# EAGLE design alim (EAGLE 4.16)
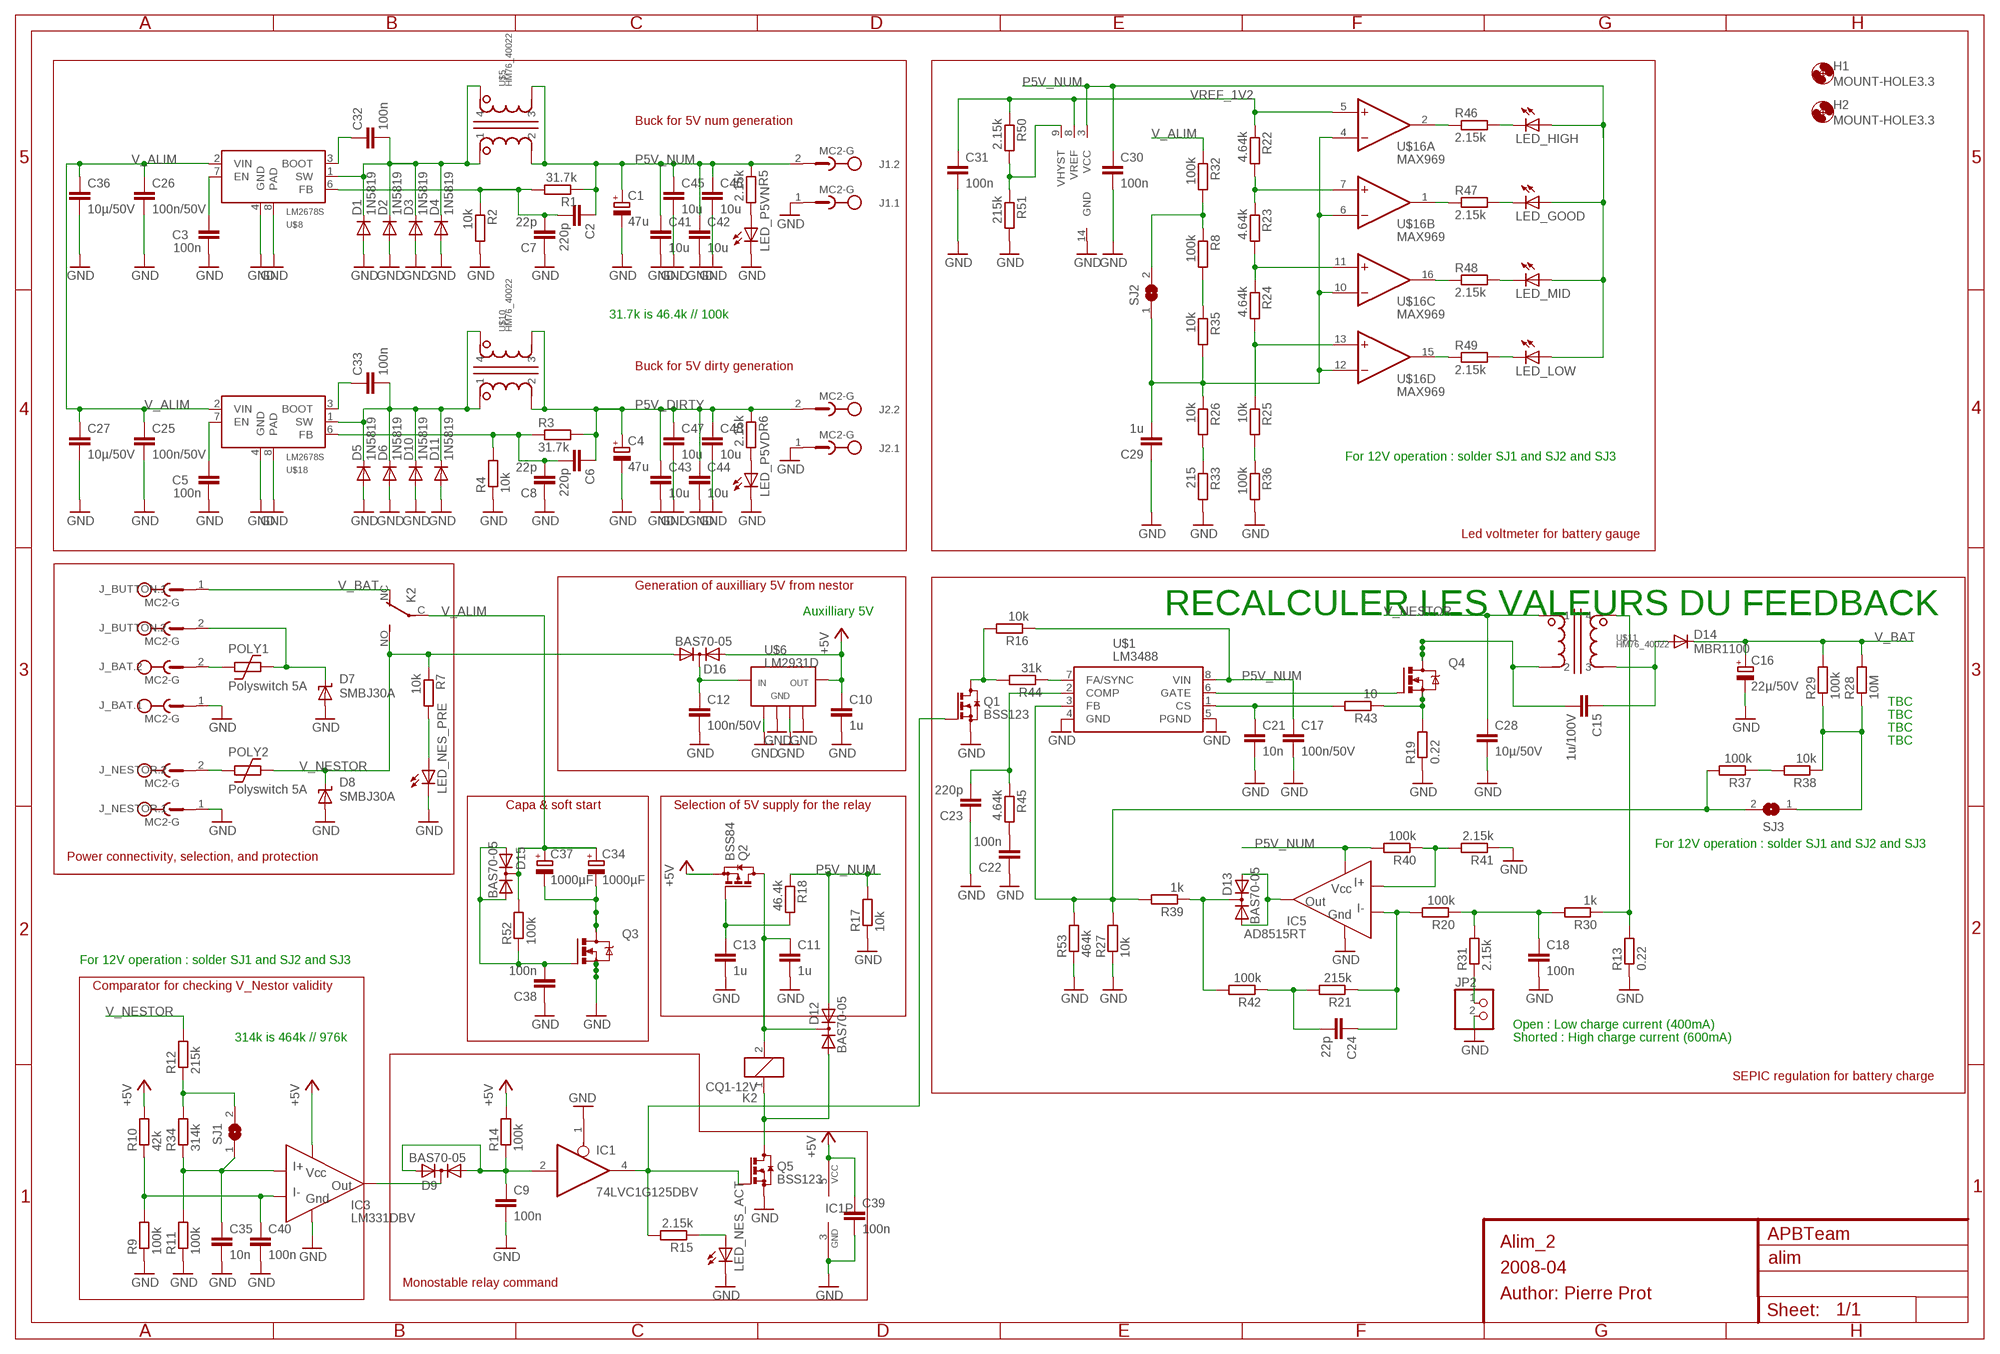
[diagram p0: schematic, sheet 1]

## Parts
C1  47u  CPOL-EUE  [PANASONIC_E]
C2  220p  C-EUC0603  [C0603]
C3  100n  C-EUC0603  [C0603]
C4  47u  CPOL-EUE  [PANASONIC_E]
C5  100n  C-EUC0603  [C0603]
C6  220p  C-EUC0603  [C0603]
C7  22p  C-EUC0603  [C0603]
C8  22p  C-EUC0603  [C0603]
C9  100n  C-EUC0603  [C0603]
C10  1u  C-EUC0603  [C0603]
C11  1u  C-EUC0603  [C0603]
C12  100n/50V  C-EUC0805  [C0805]
C13  1u  C-EUC0603  [C0603]
C15  1u/100V  C-EUC1206K  [C1206K]
C16  22µ/50V  CPOL-EUE  [PANASONIC_E]
C17  100n/50V  C-EUC0805  [C0805]
C18  100n  C-EUC0603  [C0603]
C21  10n  C-EU0603_SMALL  [0603_SMALL]
C22  100n  C-EU0603_SMALL  [0603_SMALL]
C23  220p  C-EU0603_SMALL  [0603_SMALL]
C24  22p  C-EUC0603  [C0603]
C25  100n/50V  C-EUC0805  [C0805]
C26  100n/50V  C-EUC0805  [C0805]
C27  10µ/50V  C-EUC2220K  [C2220K]
C28  10µ/50V  C-EUC2220K  [C2220K]
C29  1u  C-EUC0603  [C0603]
C30  100n  C-EUC0603  [C0603]
C31  100n  C-EUC0603  [C0603]
C32  100n  C-EUC0603  [C0603]
C33  100n  C-EUC0603  [C0603]
C34  1000µF  CPOL-EU""  [E5-13_RADIAL$]
C35  10n  C-EUC0603  [C0603]
C36  10µ/50V  C-EUC2220K  [C2220K]
C37  1000µF  CPOL-EU""  [E5-13_RADIAL$]
C38  100n  C-EUC0603  [C0603]
C39  100n  C-EUC0603  [C0603]
C40  100n  C-EU0603_SMALL  [0603_SMALL]
C41  10u  C-EUC0603  [C0603]
C42  10u  C-EUC0603  [C0603]
C43  10u  C-EUC0603  [C0603]
C44  10u  C-EUC0603  [C0603]
C45  10u  C-EUC0603  [C0603]
C46  10u  C-EUC0603  [C0603]
C47  10u  C-EUC0603  [C0603]
C48  10u  C-EUC0603  [C0603]
D1  1N5819  DIODE-DO41-10  [DO41-10]
D2  1N5819  DIODE-DO41-10  [DO41-10]
D3  1N5819  DIODE-DO41-10  [DO41-10]
D4  1N5819  DIODE-DO41-10  [DO41-10]
D5  1N5819  DIODE-DO41-10  [DO41-10]
D6  1N5819  DIODE-DO41-10  [DO41-10]
D7  SMBJ30A  SUPPRESSOR-SMBJ  [SMBJ]
D8  SMBJ30A  SUPPRESSOR-SMBJ  [SMBJ]
D9  BAS70-05  [SOT23]
D10  1N5819  DIODE-DO41-10  [DO41-10]
D11  1N5819  DIODE-DO41-10  [DO41-10]
D12  BAS70-05  [SOT23]
D13  BAS70-05  [SOT23]
D14  MBR1100  DIODE-DO41-10  [DO41-10]
D15  BAS70-05  [SOT23]
D16  BAS70-05  [SOT23]
H1  MOUNT-HOLE3.3  [3,3]
H2  MOUNT-HOLE3.3  [3,3]
IC1  74LVC1G125DBV  [SOT23-5]
IC3  LM331DBV  [SOT23-6]
IC5  AD8515RT  [SOT23-5]
J1  MC2-G  [MC2-G]
J2  MC2-G  [MC2-G]
J_BAT  MC2-G  [MC2-G]
J_BUTTON  MC2-G  [MC2-G]
J_NESTOR  MC2-G  [MC2-G]
JP2  PINHD-1X2  [1X02]
K2  CQ1-12V  [CQ1]
LED_GOOD  LEDCHIPLED_1206  [CHIPLED_1206]
LED_HIGH  LEDCHIPLED_1206  [CHIPLED_1206]
LED_LOW  LEDCHIPLED_1206  [CHIPLED_1206]
LED_MID  LEDCHIPLED_1206  [CHIPLED_1206]
LED_NES_ACT  LEDCHIPLED_1206  [CHIPLED_1206]
LED_NES_PRE  LEDCHIPLED_1206  [CHIPLED_1206]
LED_P5VD  LEDCHIPLED_1206  [CHIPLED_1206]
LED_P5VN  LEDCHIPLED_1206  [CHIPLED_1206]
POLY1  Polyswitch 5A  POLYSWITCH_0411/12  [0411/12]
POLY2  Polyswitch 5A  POLYSWITCH_0411/12  [0411/12]
Q1  BSS123  [SOT23]
Q2  BSS84  [SOT23]
Q3  N-MOSFET-SO8S  [SO-08]
Q4  N-MOSFET-SO8S  [SO-08]
Q5  BSS123  [SOT23]
R1  31.7k  R-EU_R0603  [R0603]
R2  10k  R-EU_R0603  [R0603]
R3  31.7k  R-EU_R0603  [R0603]
R4  10k  R-EU_R0603  [R0603]
R5  2.15k  R-EU_R0603  [R0603]
R6  2.15k  R-EU_R0603  [R0603]
R7  10k  R-EU_R0603  [R0603]
R8  100k  R-EU_R0603  [R0603]
R9  100k  R-EU_R0603  [R0603]
R10  42k  R-EU_R0603  [R0603]
R11  100k  R-EU_R0603  [R0603]
R12  215k  R-EU_R0603  [R0603]
R13  0.22  R-EU_R0603  [R0603]
R14  100k  R-EU_R0603  [R0603]
R15  2.15k  R-EU_R0603  [R0603]
R16  10k  R-EU_R0603  [R0603]
R17  10k  R-EU_R0603  [R0603]
R18  46.4k  R-EU_R0603  [R0603]
R19  0.22  R-EU_R0603  [R0603]
R20  100k  R-EU_R0603  [R0603]
R21  215k  R-EU_R0603  [R0603]
R22  4.64k  R-EU_R0603  [R0603]
R23  4.64k  R-EU_R0603  [R0603]
R24  4.64k  R-EU_R0603  [R0603]
R25  10k  R-EU_R0603  [R0603]
R26  10k  R-EU_R0603  [R0603]
R27  10k  R-EU_0603_SMALL  [0603_SMALL]
R28  10M  R-EU_R0603  [R0603]
R29  100k  R-EU_R0603  [R0603]
R30  1k  R-EU_R0603  [R0603]
R31  2.15k  R-EU_R0603  [R0603]
R32  100k  R-EU_R0603  [R0603]
R33  215  R-EU_R0603  [R0603]
R34  314k  R-EU_R0603  [R0603]
R35  10k  R-EU_R0603  [R0603]
R36  100k  R-EU_R0603  [R0603]
R37  100k  R-EU_R0603  [R0603]
R38  10k  R-EU_R0603  [R0603]
R39  1k  R-EU_R0603  [R0603]
R40  100k  R-EU_R0603  [R0603]
R41  2.15k  R-EU_R0603  [R0603]
R42  100k  R-EU_R0603  [R0603]
R43  10  R-EU_R0603  [R0603]
R44  31k  R-EU_R0603  [R0603]
R45  4.64k  R-EU_0603_SMALL  [0603_SMALL]
R46  2.15k  R-EU_R0603  [R0603]
R47  2.15k  R-EU_R0603  [R0603]
R48  2.15k  R-EU_R0603  [R0603]
R49  2.15k  R-EU_R0603  [R0603]
R50  2.15k  R-EU_R0603  [R0603]
R51  215k  R-EU_R0603  [R0603]
R52  100k  R-EU_R0603  [R0603]
R53  464k  R-EU_0603_SMALL  [0603_SMALL]
SJ1  SJ  [SJ]
SJ2  SJ  [SJ]
SJ3  SJ  [SJ]
U$1  LM3488  [MSOP8]
U$5  HM76_40022  HM76_40  [HM76_40]
U$6  LM2931D  LM2931  [SO08]
U$8  LM2678S  [TO263-7]
U$10  HM76_40022  HM76_40  [HM76_40]
U$11  HM76_40022  HM76_40  [HM76_40]
U$16  MAX969  [QSOP16]
U$18  LM2678S  [TO263-7]

## Nets
+5V: C10.1 C39.1 D16.2(A2) IC1.5(VCC) IC3.6(VCC) Q2.2(S) R10.2 R14.2 U$6.1(OUT)
GND: C1.- C3.1 C4.- C5.1 C7.1 C8.1 C9.2 C10.2 C11.2 C12.2 C13.2 C16.- C17.2 C18.2 C21.2 C22.1 C23.1 C25.2 C26.2 C27.2 C28.2 C29.1 C30.2 C31.2 C35.2 C36.2 C38.1 C39.2 C40.2 C41.2 C42.2 C43.2 C44.2 C45.2 C46.2 C47.2 C48.2 D1.A D2.A D3.A D4.A D5.A D6.A D7.A D8.A D10.A D11.A IC1.1(OE) IC1.3(GND) IC3.2(VSS) IC5.2(VSS) J1.1 J2.1 J_BAT.1 J_NESTOR.1 JP2.2 LED_NES_ACT.C LED_NES_PRE.C LED_P5VD.C LED_P5VN.C Q1.2(S) Q3.1(S) Q3.2(S) Q3.3(S) Q5.2(S) R2.2 R4.1 R9.1 R11.1 R13.1 R17.1 R19.1 R27.1 R33.2 R36.2 R41.1 R51.2 R53.1 U$1.4(GND) U$1.5(PGND) U$6.2(GND) U$6.3(GND2) U$6.6(GND3) U$6.7(GND4) U$8.4(GND) U$8.8(PAD) U$16.14(GND) U$18.4(GND) U$18.8(PAD)
N$1: C32.2 D1.C D2.C D3.C D4.C U$5.P$1 U$5.P$4 U$8.1(SW)
N$2: D12.1(A1) K2.1 Q5.3(D)
N$3: C2.2 C7.2 R1.2 R2.1 U$8.6(FB)
N$4: C6.2 C8.2 R3.1 R4.2 U$18.6(FB)
N$5: C5.2 U$18.7(EN)
N$6: C3.2 U$8.7(EN)
N$7: IC1.4(O) Q1.1(G) Q5.1(G) R15.2
N$8: C33.2 D5.C D6.C D10.C D11.C U$10.P$1 U$10.P$4 U$18.1(SW)
N$9: LED_P5VN.A R5.2
N$10: LED_P5VD.A R6.2
N$11: LED_NES_PRE.A R7.2
N$12: J_BAT.2 POLY1.1
N$13: J_NESTOR.2 POLY2.1
N$14: C40.1 IC3.3(I-) R9.2 R10.1
N$15: C35.1 IC3.1(I+) R11.2 R34.1 SJ1.1
N$16: C9.1 D9.1(A1) D9.2(A2) IC1.2(I) R14.1
N$17: D9.3(C) IC3.4(OUT)
N$18: LED_NES_ACT.A R15.1
N$19: C13.1 Q2.1(G) R18.2
N$20: R22.2 R23.1 U$16.7(B:+IN)
N$21: Q4.4(G) U$1.6(GATE)
N$22: D7.C J_BUTTON.2 POLY1.2
N$23: Q1.3(D) R16.2 R44.2
N$24: C11.1 D12.3(C) K2.2 Q2.3(D)
N$25: Q4.1(S) Q4.2(S) Q4.3(S) R19.2 R43.1
N$26: C21.1 R43.2 U$1.1(CS)
N$27: R46.1 U$16.2(A:OUT)
N$28: R44.1 U$1.7(FA/SYNC)
N$29: R23.2 R24.1 U$16.11(C:+IN)
N$30: R24.2 R25.1 U$16.13(D:+IN)
N$31: R50.2 R51.1 U$16.9(VHYST)
N$32: C29.2 R26.1 R35.2 SJ2.1 U$16.4(A:-IN) U$16.6(B:-IN) U$16.10(C:-IN) U$16.12(D:-IN)
N$33: R8.2 R35.1
N$34: C15.2 Q4.5(D) Q4.6(D) Q4.7(D) Q4.8(D) U$11.P$2
N$35: C15.1 D14.A U$11.P$3
N$36: R28.1 R29.1 R38.1 SJ3.1
N$37: R47.1 U$16.1(B:OUT)
N$40: R13.2 R30.1 U$11.P$4
N$41: C18.1 R20.1 R30.2 R31.2
N$42: R12.1 R34.2 SJ1.2
N$43: R8.1 R32.2 SJ2.2
N$44: C32.1 U$8.3(BOOT)
N$45: R26.2 R33.1
N$46: R25.2 R36.1
N$47: R37.1 R38.2
N$48: D13.1(A1) D13.2(A2) IC5.1(OUT)
N$49: D13.3(C) R39.1 R42.2
N$50: R27.2 R37.2 R39.2 R53.2 SJ3.2 U$1.3(FB)
N$51: C24.1 IC5.4(I-) R20.2 R21.1
N$52: IC5.3(I+) R40.1 R41.2
N$53: C24.2 R21.2 R42.1
N$54: JP2.1 R31.1
N$55: R48.1 U$16.16(C:OUT)
N$56: LED_HIGH.C R46.2
N$57: LED_GOOD.C R47.2
N$58: LED_MID.C R48.2
N$59: C23.2 R45.1 U$1.2(COMP)
N$60: C22.2 R45.2
N$61: R49.1 U$16.15(D:OUT)
N$62: LED_LOW.C R49.2
N$66: C33.1 U$18.3(BOOT)
N$68: C38.2 D15.1(A1) D15.2(A2) Q3.4(G) R52.1
N$69: C34.- C37.- Q3.5(D) Q3.6(D) Q3.7(D) Q3.8(D)
N$73: C12.1 D16.3(C) U$6.8(IN)
P5V_DIRTY: C4.+ C6.1 C43.1 C44.1 C47.1 C48.1 J2.2 R3.2 R6.1 U$10.P$2 U$10.P$3
P5V_NUM: C1.+ C2.1 C17.1 C30.1 C41.1 C42.1 C45.1 C46.1 D12.2(A2) IC5.5(VCC) J1.2 LED_GOOD.A LED_HIGH.A LED_LOW.A LED_MID.A R1.1 R5.1 R16.1 R17.2 R18.1 R40.2 U$1.8(VIN) U$5.P$2 U$5.P$3 U$16.3(VCC)
V_ALIM: C25.1 C26.1 C27.1 C34.+ C36.1 C37.+ D15.3(C) K2.C(2:P) R32.1 R52.2 U$8.2(VIN) U$18.2(VIN)
V_BAT: C16.+ D14.C J_BUTTON.1 K2.NC(2:O) R28.2 R29.2
V_NESTOR: C28.1 D8.C D16.1(A1) K2.NO(2:S) POLY2.2 R7.1 R12.2 U$11.P$1
VREF_1V2: C31.1 R22.1 R50.1 U$16.5(A:+IN) U$16.8(VREF)

## Notes on the sheet
- Buck for 5V num generation
- 31.7k is 46.4k // 100k
- Buck for 5V dirty generation
- For 12V operation : solder SJ1 and SJ2 and SJ3
- Led voltmeter for battery gauge
- Generation of auxilliary 5V from nestor
- Auxilliary 5V | RECALCULER LES VALEURS DU FEEDBACK
- TBC
- TBC
- TBC
- TBC
- Capa & soft start | Selection of 5V supply for the relay
- For 12V operation : solder SJ1 and SJ2 and SJ3
- Power connectivity, selection, and protection
- For 12V operation : solder SJ1 and SJ2 and SJ3
- Comparator for checking V_Nestor validity
- Open : Low charge current (400mA)
- 314k is 464k // 976k | Shorted : High charge current (600mA)
- SEPIC regulation for battery charge
- APBTeam
- Alim_2
- 2008-04
- Monostable relay command
- Author: Pierre Prot

## Library data of the parts
C1 C4 C16 C34 C37 = rcl:CPOL-EU: POLARIZED CAPACITOR, European symbol
C2 C3 C5-C13 C15 C17 C18 C21-C33 C35 C36 C38-C48 = rcl:C-EU: CAPACITOR, European symbol
D1-D6 D10 D11 D14 = diode:DIODE-: DIODE
D7 D8 = diode:SUPPRESSOR-: Suppressor diode
D9 D12 D13 D15 D16 = diode:BAS70-05: Silicon Schottky Diodes General-purpose diode for high-speed switching
H1 H2 = holes:MOUNT-HOLE: MOUNTING HOLE with drill center marker
IC1 = 74xx-little-us:74*1G125: Single Bus Buffer Gate with 3-State Output
IC3 = robot:LM331
IC5 = robot:AD8515
J1 J2 J_BAT J_BUTTON J_NESTOR = con-phoenix-381_l:MC2-G: Mini-Combicon 3.81mm horizontal 2-polig MC 1,5/2-G-3,81 Artikel-Nr. 1803277 mit Gegenstecker MC 1,5/2-ST-3,81 Artikel-Nr. 1803578
JP2 = pinhead:PINHD-1X2: PIN HEADER
K2 = relay:CQ1-12V: AUTOMOTIVE QUIET RELAY NAiS Source: http://www.mew-europe.com/.. en_ds_61208_0000.pdf
LED_GOOD LED_HIGH LED_LOW LED_MID LED_NES_ACT LED_NES_PRE LED_P5VD LED_P5VN = led:LED: LED OSRAM: - CHIPLED LG R971, LG N971, LY N971, LG Q971, LY Q971, LO R971, LY R971 LH N974, LH R974 LS Q976, LO Q976, LY Q976 LO Q996 - Hyper CHIPLED LW Q18S LB Q993, LB Q99A, LB R99A - SideLED LS A670, LO A670, LY A670, LG A670, LP A670 LB A673, LV A673, LT A673, LW A673 LH A674 LY A675 LS A676, LA A676, LO A676, LY A676, LW A676 LS A679, LY A679, LG A679 - Hyper Micro SIDELED® LS Y876, LA Y876, LO Y876, LY Y876 LT Y87S - SmartLED LW L88C, LW L88S LB L89C, LB L89S, LG L890 LS L89K, LO L89K, LY L89K LS L896, LA L896, LO L896, LY L896 - TOPLED LS T670, LO T670, LY T670, LG T670, LP T670 LSG T670, LSP T670, LSY T670, LOP T670, LYG T670 LG T671, LOG T671, LSG T671 LB T673, LV T673, LT T673, LW T673 LH T674 LS T676, LA T676, LO T676, LY T676, LB T676, LH T676, LSB T676, LW T676 LB T67C, LV T67C, LT T67C, LS T67K, LO T67K, LY T67K, LW E67C LS E67B, LA E67B, LO E67B, LY E67B, LB E67C, LV E67C, LT E67C LW T67C LS T679, LY T679, LG T679 LS T770, LO T770, LY T770, LG T770, LP T770 LB T773, LV T773, LT T773, LW T773 LH T774 LS E675, LA E675, LY E675, LS T675 LS T776, LA T776, LO T776, LY T776, LB T776 LHGB T686 LT T68C, LB T68C - Hyper Mini TOPLED® LB M676 - Mini TOPLED Santana® LG M470 LS M47K, LO M47K, LY M47K Source: http://www.osram.convergy.de/
POLY1 POLY2 = apbteam_polyswitch:POLYSWITCH_: POLYSWITCH
Q1 Q5 = transistor-small-signal:BSS123: N-CHANNEL MOS FET
Q2 = transistor-small-signal:BSS84: P-CHANNEL MOS FET
Q3 Q4 = transistor-power:N-MOSFET-SO8: N-Channel MOSFET Example: FDS7760A; N-Channel Logic Level PowerTrench® MOSFET FDS2572; N-Channel UltraFET® Trench MOSFET Source: www.fairchildsemi.com
R1-R53 = rcl:R-EU_: RESISTOR, European symbol
SJ1-SJ3 = jumper:SJ: SMD solder JUMPER
U$1 = robot:LM3488
U$5 U$10 U$11 = robot:HM76_40
U$6 = robot:LM2931
U$8 U$18 = robot:LM2678
U$16 = maxim-7:MAX969

## Board
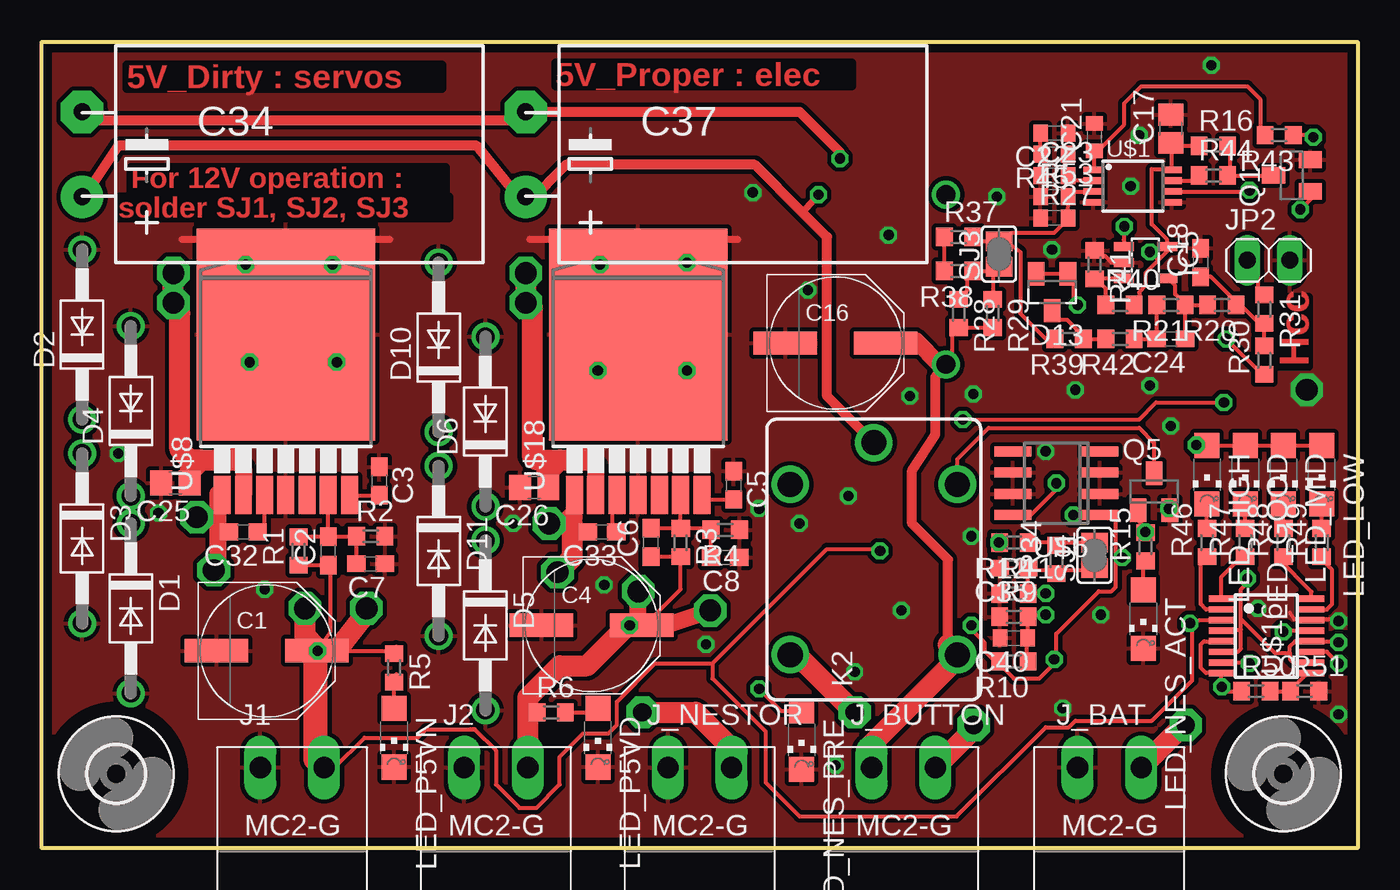
[diagram p1: board, top side]
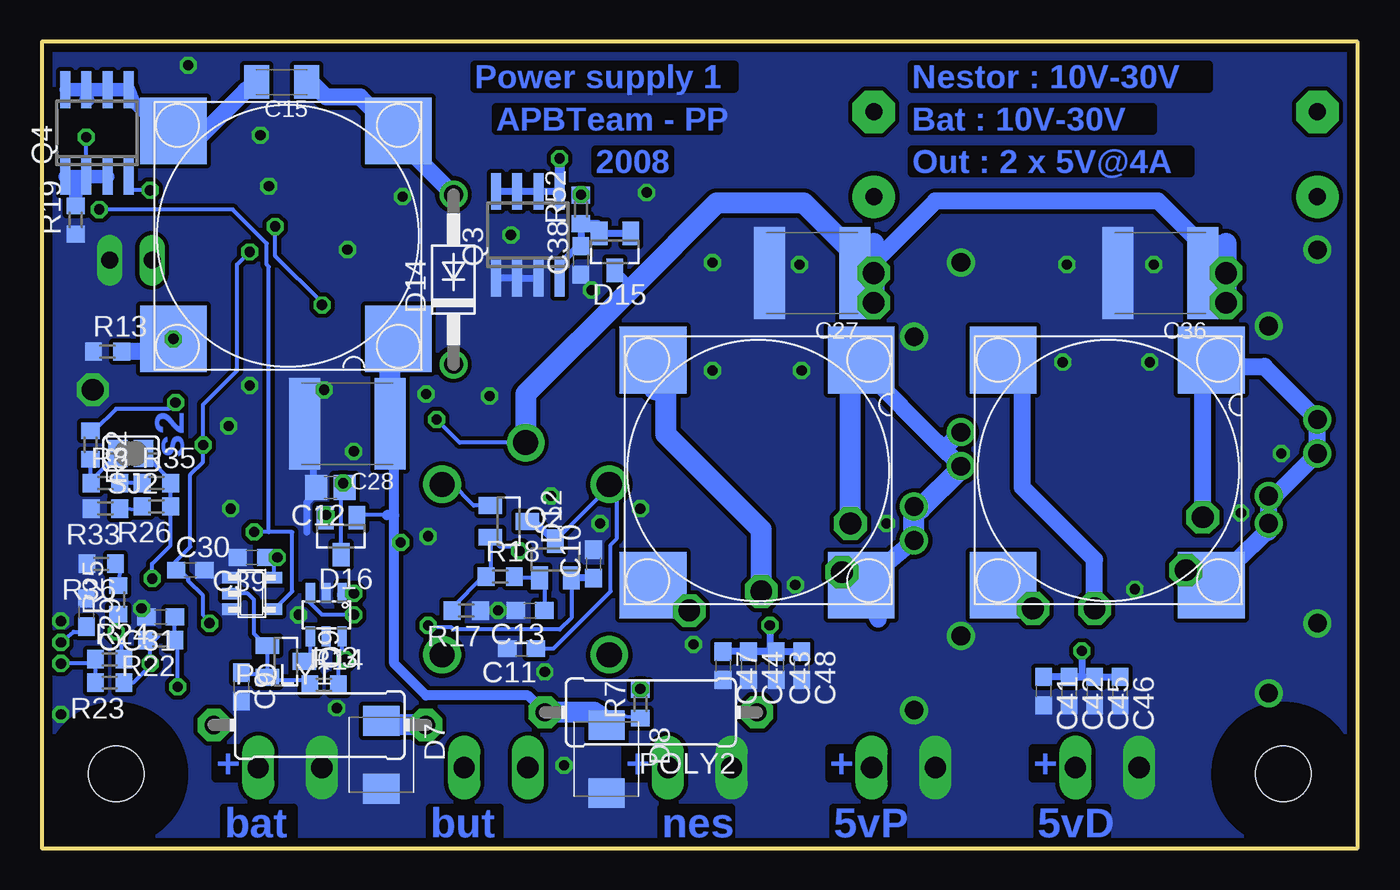
[diagram p2: board, bottom side, seen from below]

Size 78.74 x 48.26 mm. Coordinates in mm from the lower left corner, seen from the top.
Outline: 78.74,0 0,0 0,48.26 78.74,48.26 78.74,0
Copper layers (1*16): Top 0.035mm / dielectric 1.5mm / Bottom 0.035mm
Design rules "10mils": minimum track width 10mil, minimum drill 24mil, track to track 10mil, track to pad 10mil, pad to pad 10mil, via to via 10mil, smd to smd 0mil, copper to edge 20mil, drill to drill 8mil, minimum pad ring 10mil, minimum via ring 8mil, stop-mask expansion 0mil, vias tented up to drill 0mil, thermal gap 10mil

### Footprints (pad centres in the part's own frame; a part is rotated, then mirrored left to right if it is on the bottom)
PANASONIC_E = smd 3.8 x 1.4: + 3,0; - -3,0
C0603 = smd 1.1 x 1: 1 -0.85,0; 2 0.85,0
C0805 = smd 1.3 x 1.5: 1 -0.85,0; 2 0.85,0
C1206K = smd 1.5 x 2: 1 -1.5,0; 2 1.5,0
0603_SMALL = smd 0.864 x 1.016: 1 -0.825,0; 2 0.825,0
C2220K = smd 1.85 x 5.5: 1 -2.55,0; 2 2.55,0
E5-13_RADIAL$ = drill 1.016 pad 2.54 round: + 2.54,0 | drill 1.016 pad 2.54 octagon: - -2.54,0
DO41-10 = drill 1.118 round: A 5.08,0; C -5.08,0
SMBJ = smd 1.78 x 2.16: A 2.04,0; C -2.03,0
SOT23 = smd 1 x 1.4: 1 -0.95,-1.1; 2 0.95,-1.1; 3 0,1.1
3,3 = hole 3.3: 0,0
SOT23-5 = smd 0.69 x 0.99: 1 -0.95,-1.29; 2 0,-1.29; 3 0.95,-1.29; 4 0.95,1.3; 5 -0.95,1.3
SOT23-6 = smd 0.55 x 1.2: 1 -0.95,-1.3; 2 0,-1.3; 3 0.95,-1.3; 4 0.95,1.3; 5 0,1.303; 6 -0.95,1.3
SOT23-5' = smd 0.55 x 1.2: 1 -0.95,-1.3; 2 0,-1.3; 3 0.95,-1.3; 4 0.95,1.3; 5 -0.95,1.3
MC2-G = drill 1.27 long: 1 -1.905,0; 2 1.905,0
1X02 = drill 1.016 long: 1 -1.27,0; 2 1.27,0
CQ1 = drill 1.5 round: 1 4.5,-5; 2 4.5,5; C 7,0; NC -5.7,-5; NO -5.7,5
CHIPLED_1206 = smd 1.5 x 1.5: A 0,-1.75; C 0,1.75
0411/12 = drill 1.1 pad 1.93 octagon: 1 -6.35,0; 2 6.35,0
SO-08 = smd 0.6 x 2.2: 1 -1.905,-2.6; 2 -0.635,-2.6; 3 0.635,-2.6; 4 1.905,-2.6; 5 1.905,2.6; 6 0.635,2.6; 7 -0.635,2.6; 8 -1.905,2.6
R0603 = smd 1 x 1.1: 1 -0.85,0; 2 0.85,0
SJ = smd 1.168 x 1.6: 1 -0.762,0; 2 0.762,0
MSOP8@1 = smd 0.395 x 1.2: 1 -0.975,-2.35; 2 -0.325,-2.35; 3 0.325,-2.35; 4 0.975,-2.35; 5 0.975,2.35; 6 0.325,2.35; 7 -0.325,2.35; 8 -0.975,2.35
HM76_40 = smd 3.988 x 3.988: P$1 -6.604,5.842; P$2 6.858,-6.604; P$3 -6.604,-6.604; P$4 6.858,5.842
SO08 = smd 0.6 x 2.2: 1 -1.905,-2.6; 2 -0.635,-2.6; 3 0.635,-2.6; 4 1.905,-2.6; 5 1.905,2.6; 6 0.635,2.6; 7 -0.635,2.6; 8 -1.905,2.6
TO263-7 = smd 1.016 x 2.286: 1 -3.81,-5.791; 2 -2.54,-5.791; 3 -1.27,-5.791; 4 0,-5.791; 5 1.27,-5.791; 6 2.54,-5.791; 7 3.81,-5.791 | smd 10.668 x 12.7: 8 0,3.81
QSOP16 = smd 0.381 x 1.524: 1 -2.223,-2.69; 2 -1.587,-2.69; 3 -0.953,-2.69; 4 -0.318,-2.69; 5 0.318,-2.69; 6 0.953,-2.69; 7 1.587,-2.69; 8 2.223,-2.69; 9 2.223,2.69; 10 1.587,2.69; 11 0.953,2.69; 12 0.318,2.69; 13 -0.318,2.69; 14 -0.953,2.69; 15 -1.587,2.69; 16 -2.223,2.69

### Placement (x,y rotation side)
C1  13.46,11.81 0 top
C2  17.14,17.78 90 top
C3  20.19,21.97 270 top
C4  32.89,13.34 0 top
C5  41.4,21.72 270 top
C6  36.45,18.29 90 top
C7  19.68,17.02 180 top
C8  40.89,17.4 180 top
C9  66.8,9.65 270 bottom
C10  45.72,17.02 90 bottom
C11  50.04,11.94 180 bottom
C12  61.47,21.59 180 bottom
C13  49.53,14.22 180 bottom
C15  64.39,45.85 180 bottom
C16  47.5,30.23 0 top
C17  67.56,43.05 90 top
C18  69.34,35.05 90 top
C21  62.99,42.55 90 top
C22  60.58,42.8 180 top
C23  60.58,40.26 0 top
C24  67.56,30.48 180 top
C25  8,21.84 180 top
C26  29.46,21.59 180 top
C27  32.64,34.42 180 bottom
C28  60.45,25.4 180 bottom
C29  76.07,14.1 270 bottom
C30  69.85,16.64 0 bottom
C31  71.63,13.84 180 bottom
C32  12.06,18.92 180 top
C33  33.53,18.92 180 top
C34  2.41,41.53 270 top
C35  58.17,16.76 180 top
C36  11.81,34.42 180 bottom
C37  28.96,41.53 270 top
C38  46.48,35.18 90 bottom
C39  66.17,17.4 180 bottom
C40  58.17,12.57 180 top
C41  18.8,9.4 270 bottom
C42  17.27,9.4 270 bottom
C43  34.8,10.92 270 bottom
C44  36.45,10.92 270 bottom
C45  15.75,9.4 270 bottom
C46  14.22,9.4 270 bottom
C47  37.97,10.92 270 bottom
C48  33.27,10.92 270 bottom
D1  5.33,14.35 270 top
D2  2.41,30.73 90 top
D3  2.41,18.54 270 top
D4  5.33,26.16 90 top
D5  26.54,13.34 270 top
D6  26.54,25.53 90 top
D7  58.42,5.59 270 bottom
D8  44.96,5.33 270 bottom
D9  64.14,11.18 270 bottom
D10  23.75,29.97 90 top
D11  23.75,17.78 270 top
D12  50.8,19.56 270 bottom
D13  60.45,33.27 180 top
D14  54.1,34.04 90 bottom
D15  44.45,35.69 180 bottom
D16  60.83,18.67 180 bottom
H1  4.45,4.45 90 top
H2  74.3,4.45 90 top
IC1  66.17,15.24 270 bottom
IC3  61.72,13.97 180 bottom
IC5  AD8515RT  [SOT23-5']  66.04,35.05 270 top
J1  14.99,4.83 0 top
J2  27.18,4.83 0 top
J_BAT  63.88,4.83 0 top
J_BUTTON  51.56,4.83 0 top
J_NESTOR  39.37,4.83 0 top
JP2  73.41,35.18 0 top
K2  49.78,17.27 90 top
LED_GOOD  72.01,22.35 180 top
LED_HIGH  69.72,22.35 180 top
LED_LOW  76.58,22.35 180 top
LED_MID  74.3,22.35 180 top
LED_NES_ACT  65.91,13.72 180 top
LED_NES_PRE  45.47,6.48 180 top
LED_P5VD  33.27,6.6 180 top
LED_P5VN  21.08,6.6 180 top
POLY1  62.1,7.37 0 bottom
POLY2  42.29,8.13 180 bottom
Q1  74.8,40.26 90 top
Q2  48.01,17.27 0 bottom
Q3  49.66,36.7 0 bottom
Q4  75.44,42.8 0 bottom
Q5  66.55,21.34 0 top
R1  15.37,17.78 90 top
R2  19.68,18.67 0 top
R3  38.23,18.29 270 top
R4  40.89,19.05 180 top
R5  21.08,10.79 270 top
R6  30.48,8.13 0 top
R7  42.93,8.64 90 bottom
R8  74.93,21.84 0 bottom
R9  58.17,13.84 0 top
R10  58.17,11.18 180 top
R11  58.17,15.24 0 top
R12  58.17,18.29 180 top
R13  74.8,29.72 0 bottom
R14  61.85,9.78 0 bottom
R15  66.04,18.03 90 top
R16  70.1,42.04 0 top
R17  53.34,14.22 180 bottom
R18  51.31,16.26 0 bottom
R19  76.71,37.59 90 bottom
R20  70.61,32.51 180 top
R21  67.56,32.51 180 top
R22  71.63,12.45 180 bottom
R23  74.68,9.91 180 bottom
R24  74.68,11.3 0 bottom
R25  74.17,14.86 90 bottom
R26  71.88,20.45 180 bottom
R27  60.58,37.72 0 top
R28  54.86,32 270 top
R29  56.9,32 270 top
R30  73.15,29.21 90 top
R31  73.15,32.26 270 top
R32  75.82,24.13 270 bottom
R33  74.93,20.32 180 bottom
R34  60.71,17.27 90 top
R35  71.88,21.84 0 bottom
R36  75.18,17.02 180 bottom
R37  54.86,36.58 0 top
R38  54.86,34.54 180 top
R39  61.47,30.48 180 top
R40  64.52,32.51 0 top
R41  62.99,34.92 270 top
R42  64.52,30.48 180 top
R43  74.04,42.67 180 top
R44  70.1,40.26 0 top
R45  60.58,41.53 180 top
R46  69.72,18.29 90 top
R47  72.01,18.29 90 top
R48  74.3,18.29 90 top
R49  76.58,18.29 90 top
R50  72.64,9.4 0 top
R51  75.56,9.4 0 top
R52  46.48,38.23 90 bottom
R53  60.58,38.99 0 top
SJ1  62.99,17.53 90 top
SJ2  73.41,23.62 180 bottom
SJ3  57.28,35.56 90 top
U$1  LM3488  [MSOP8@1]  65.28,39.62 270 top
U$5  14.61,22.61 270 bottom
U$6  60.71,21.84 90 top
U$8  14.61,26.92 0 top
U$10  35.56,22.61 270 bottom
U$11  64.01,36.32 180 bottom
U$16  73.28,12.7 270 top
U$18  35.69,26.92 0 top

### Tracks (layer width: path | path; a pad name or v marks a point on that pad's centre or on a via)
+5V  (via drill 0.61)
  Top 0.254: R10.2 57.32,11.14 57.06,11.26 58.17,10.16 59.69,10.16 60.58,11.05 | v55.63,13.34 55.63,13.08 56.39,12.32 56.39,11.81 57.02,11.18 R10.2 | R10.2 57.15,11.56 | 60.58,11.05 60.71,11.18 60.71,12.83 63.25,15.37 64.01,15.37 64.26,15.62 | 64.26,15.62 64.26,19.56 63.88,19.94 63.25,19.94 | 60.58,11.05 v60.58,11.3 | 63.25,19.94 v61.72,19.94 | 63.25,19.94 U$6.1 | 64.26,15.62 64.26,17.14 v64.64,17.4
  Bottom 0.254: Q2.2 47.06,13.78 47.75,13.08 54.1,13.08 54.23,13.21 55.63,13.21 v55.63,13.34 | IC3.6 60.77,11.62 v60.58,11.3 60.58,11.18 61,10.76 R14.2 | IC1.5 64.87,16.99 65.28,17.4 | 65.28,17.4 65.02,17.4 | 61.34,20.32 v61.72,19.94 61.72,19.81 61.77,19.77 D16.2 | 65.28,17.4 C39.1 | v64.64,17.4 65.28,17.4
  Bottom 0.406: 47.12,16.17 47.12,16.38 | 47.12,16.17 Q2.2 | C10.1 47.12,16.17
GND  (via drill 0.61, 1.3)
  Top 0.254: IC5.2 64.01,35.05 63.63,35.43 63.37,35.43 62.99,35.81 R41.1 | 77.53,13.65 77.6,13.72 | 77.34,13.72 74.93,13.72 74.68,14.1
  Top 0.406: 8.38,36.45 20.83,36.45 | 29.21,36.45 41.66,36.45
  Bottom 0.254: 62.48,21.59 62.48,21.84
  Bottom 0.406: Q3.1 50.35,34.1 50.29,34.16 Q3.2 49.08,34.1 49.02,34.16 Q3.3 | C12.2 62.48,21.59 | C28.2 62.48,25.4 | 62.48,21.84 62.48,22.1 | 62.48,22.1 62.48,23.62 | 62.48,22.1 62.36,22.1 | 62.48,21.08 62.87,20.7 62.87,18.92
  other vias: 51.44,14.22 45.34,19.43 48.26,21.08 47.5,4.95 12.45,29.08 17.4,34.92 17.65,29.08 33.27,28.57 38.61,35.05 4.57,23.62 6.99,20.07 63.37,13.97 61.85,27.43 55.75,27.18 55.63,18.67 42.55,39.24 50.67,36.7 61.09,8.38 28.19,19.43 48.64,10.54 75.69,27.43 60.07,23.75 77.6,8 67.44,20.32 38.61,28.57 13.34,15.49 12.19,34.92 33.66,15.75 51.94,27.05 33.4,34.92 39.75,12.19 65.66,42.67 60.45,35.81 57.15,38.99 66.29,27.69 67.56,25.27 65.15,39.62 69.98,46.86 72.77,14.35 77.6,13.59 42.93,20.32 45.85,33.4
  pour Bottom (isolate 0.254, no thermals): 0.25,0.25 0.25,48.01 78.49,48.01 78.49,0.25
  pour Top (isolate 0.254): 0.51,0.51 0.51,47.75 78.23,47.75 78.23,0.51
N$1  (via drill 1.3)
  Top 0.254: 11.21,19.01 C32.2
  Top 0.406: 11.21,19.01 10.63,19.01 10.54,18.92
  Top 1.016: v10.29,16.64 10.54,16.89 10.54,18.92 10.54,19.81 | U$8.1 10.79,21.21 10.67,21.34 10.54,21.21 10.54,19.81 | 10.54,19.81 v9.27,19.81
  Bottom 1.016: 8.64,28.83 5.59,28.83 D2.C D3.C 5.08,20.95 5.08,20.83 | D4.C 5.33,20.95 5.21,20.83 5.08,20.83 | D1.C 5.33,18.92 | D1.C D4.C | D1.C 5.33,19.05 U$5.P$4 10.16,15.37 v10.29,16.64 | D4.C 5.08,20.83 | D4.C 4.95,21.08 | 8.64,28.83 U$5.P$1 | v9.27,19.81 9.27,28.19 8.64,28.83
N$2
  Top 0.254: K2.1 54.78,23.29 56.64,25.15 65.66,25.15 66.55,24.26 Q5.3
  Bottom 0.254: D12.1 52.89,20.51 54.23,21.84 54.74,21.84 54.81,21.77 | 54.81,21.77 54.86,21.72 | 54.81,21.77 K2.1
N$3
  Top 0.254: C2.2 R1.2 | C2.2 U$8.6 | C2.2 18.88,18.63 18.92,18.67 | 18.92,18.67 R2.1 | C7.2 18.84,18.58 18.92,18.67
N$4
  Top 0.254: 38.23,19.3 38.23,19.43 38.31,19.14 R3.1 | R3.1 C6.2 | R3.1 38.23,19.3 | 38.23,19.3 U$18.6 | R3.1 39.84,19.14 40.01,19.3 R4.2 40.04,19.22 40.01,19.18 40.04,19.14 C8.2
N$5
  Top 0.254: 39.5,20.87 39.41,20.87 | 39.5,20.87 C5.2 | U$18.7 39.5,20.87
N$6
  Top 0.254: U$8.7 18.41,21.21 18.5,21.12 C3.2
N$7  (via drill 0.61, 0.61 pad 1.02)
  Top 0.254: R15.2 v66.04,18.92 66.17,19.05 65.6,19.62 Q5.1 | Q1.1 75.9,38.82 v75.31,38.23
  Bottom 0.254: IC1.4 64.83,14.29 63.75,15.37 63.75,18.92 65.15,18.92 | 65.15,18.92 v66.04,18.92 | v75.31,38.23 67.31,38.23 65.28,36.2 65.28,34.92 65.15,34.8 65.15,18.92
N$8  (via drill 1.3)
  Top 0.254: C33.2 32.13,18.92 31.88,19.18 31.75,19.43 31.75,19.81 U$18.1
  Top 0.406: C33.2 32.04,19.14 31.75,19.43
  Top 1.27: v30.86,16.51 30.73,16.38 | v30.86,16.51 31.11,16.76 | 31.37,19.43 31.11,19.43 | 31.75,19.81 31.37,19.43 | 31.37,19.43 v30.35,19.43 | 31.75,19.43 31.75,17.4 v30.86,16.51
  Bottom 0.254: U$10.P$4 v30.86,16.51
  Bottom 1.016: 26.42,19.94 D5.C U$10.P$4 28.7,13.72 | 25.15,24.26 24.77,23.88 D10.C | 29.46,28.57 25.15,24.26 | 25.15,24.26 D11.C 24,22.86
  Bottom 1.27: D5.C D6.C 26.16,20.32 23.75,22.73 | U$10.P$1 29.46,28.57 30.35,27.43 v30.35,19.43
N$9
  Top 0.254: R5.2 21.21,10.41 21.08,10.29 LED_P5VN.A
N$10
  Top 0.254: 33.27,8.13 LED_P5VD.A | R6.2 33.27,8.13 | 33.27,8.13 33.4,8
N$11  (via drill 0.61)
  Top 0.254: LED_NES_PRE.A 44.22,8.23 v42.93,9.53
  Bottom 0.254: 42.93,9.4 R7.2 v42.93,9.53
N$12
  Top 1.27: POLY1.1 68.33,7.37 J_BAT.2
N$13
  Top 1.27: POLY2.1 39.12,8.13 41.27,5.97 J_NESTOR.2
N$14  (via drill 0.61)
  Top 0.254: v60.07,13.97 59.18,13.97 R9.2 59.02,12.66 58.93,12.57 | R10.1 59.02,11.6 58.93,11.68 58.93,12.57 | C40.1 58.93,12.57
  Bottom 0.254: v60.07,13.97 61.98,13.97 62.74,14.73 62.74,15.24 62.77,15.4 IC3.3
N$15  (via drill 0.61)
  Top 0.254: 59.18,16.64 60.58,16.64 | 60.58,16.64 62.87,16.64 SJ1.1 | 59.18,16.64 C35.1 | 59.18,16.64 59.02,16.47 R11.2 v60.07,15.24 | R34.1 60.71,16.51 60.58,16.64
  Bottom 0.254: IC3.1 60.9,15.05 60.96,15.11 60.96,15.24 v60.07,15.24
N$16
  Bottom 0.254: 65.22,10.23 65.15,10.16 | D9.2 65.22,10.23 | D9.1 65.23,10.24 65.22,10.23 | R14.1 62.74,9.78 62.99,10.03 64.9,10.03 65.15,10.29 65.21,10.23 D9.2 | D9.2 65.34,10.23 65.53,10.41 66.42,10.41 66.55,10.54 C9.1 | D9.1 65.08,12.13 65.02,12.06 64.9,12.19 | IC1.2 66.42,15.24 66.04,14.86 66.04,12.83 65.34,12.13 D9.1
N$17
  Bottom 0.254: D9.3 62.99,11.18 62.67,11.37 IC3.4
N$18
  Top 0.254: R15.1 66.04,17.14 65.91,17.02 LED_NES_ACT.A
N$19
  Bottom 0.254: R18.2 50.46,16.17 50.42,16.13 50.38,16.17 Q2.1 48.96,15.81 48.64,15.49 48.64,14.35 48.51,14.22 C13.1
N$20  (via drill 0.61)
  Top 0.254: U$16.7 72.2,11.11 v72.26,11.05
  Bottom 0.254: R22.2 72.14,12.83 72.01,12.7 71.75,12.7 72.26,12.19 v72.26,11.05 72.26,10.92 73.28,9.91 R23.1
N$21  (via drill 0.61)
  Top 0.254: U$1.6 72.45,39.3 v72.26,39.37
  Bottom 0.254: v72.26,39.37 73.53,39.37 Q4.4 73.53,40.26
N$22
  Top 1.27: POLY1.2 55.75,7.11 J_BUTTON.2
  Bottom 1.27: D7.C 58.17,7.37 POLY1.2
N$23
  Top 0.254: R16.2 71.12,42.04 71.12,40.26 R44.2 74.3,40.26 | 74.3,40.26 Q1.3 | 74.3,40.26 74.3,40.13
N$24
  Bottom 0.254: C11.1 48.13,11.94 44.7,15.37 44.7,18.16 44.32,18.54 44.32,21.21 44.83,21.72 | 44.83,21.72 44.32,20.95 | Q2.3 48.01,18.41 44.83,21.59 44.83,21.72 | 44.83,21.72 K2.2
  Bottom 0.406: Q2.3 48.22,18.5 49.15,19.43 49.7,19.47 D12.3
N$25  (via drill 0.61)
  Top 0.254: R43.1 75.95,42.67 v76.07,42.55
  Bottom 0.254: 76.07,40.13 Q4.2 v76.07,42.55
  Bottom 0.813: Q4.2 76.71,40.2 | 76.71,40.2 Q4.1 | Q4.2 Q4.3 Q4.2 | 76.71,40.2 R19.2
N$26
  Top 0.254: R43.2 73.28,42.67 72.9,43.05 72.9,44.83 72.14,45.59 65.79,45.59 64.77,44.58 64.77,43.31 63.18,41.72 C21.1 62.99,40.64 62.95,40.6 U$1.1
N$27
  Top 0.254: U$16.2 69.66,14.29 69.34,14.61 69.34,17.14 69.64,17.44 R46.1
N$28
  Top 0.254: R44.1 69.38,40.09 69.34,40.13 69.29,39.95 U$1.7
N$29  (via drill 0.61)
  Top 0.254: U$16.11 76.9,11.75 v77.6,11.05
  Bottom 0.254: R23.2 75.27,9.69 75.18,9.78 75.53,9.74 R24.1 75.69,11.05 v77.6,11.05
N$30  (via drill 0.61)
  Top 0.254: v74.3,12.95 74.17,12.95 74.23,13.02 U$16.13
  Bottom 0.254: R25.1 74.3,13.59 v74.3,12.95 73.95,12.61 73.95,11.47 73.91,11.43 R24.2
N$31
  Top 0.254: U$16.9 75.75,10.48 74.8,9.53 R51.1 | R51.1 75.06,9.27 | R50.2 R51.1
N$32  (via drill 0.61, 0.61 pad 1.02)
  Top 0.254: U$16.6 71.56,11.75 71.75,11.94 71.75,13.08 | v72.14,16.13 72.14,15.88 71.75,15.49 71.75,13.72 | U$16.4 71.69,13.02 71.75,13.08 | U$16.10 74.87,11.11 74.68,11.3 74.68,11.68 | 74.68,11.68 74.68,12.06 74.99,12.38 U$16.12 77.41,12.38 v77.6,12.32 77.34,12.45 | 71.75,13.08 71.75,13.72 | 71.75,13.72 73.79,11.68 74.68,11.68
  Bottom 0.254: C29.2 76.33,12.95 76.83,12.95 v77.6,12.32 | SJ2.1 71.03,22.01 R35.2 70.87,21.84 71.03,21.68 R26.1 71.03,18.12 72.14,17.02 v72.14,16.13
N$33
  Bottom 0.254: R35.1 R8.2
N$34
  Bottom 0.406: Q4.8 77.09,45.4 77.09,45.34 | Q4.7 76.07,44.83
  Bottom 0.813: U$11.P$2 70.74,42.16 73.28,44.7 Q4.5 75,45.4 | 75,45.4 74.8,45.47 Q4.6 75,45.4 | 75,45.4 Q4.7 77.09,45.4 77.28,45.4 | 76.07,44.83 76.01,44.76
  Bottom 1.016: C15.2 65.79,45.72 65.91,45.85 66.55,45.34 69.72,42.16 U$11.P$2 70.61,42.04
N$35
  Bottom 1.016: C15.1 62.74,45.97 61.72,44.96 59.69,44.96 57.66,42.93 U$11.P$3 57.53,42.8 56.52,41.78 56.52,41.53 D14.A
N$36
  Top 0.254: SJ3.1 57.4,34.67 57.28,34.54 56.9,34.54 | 56.9,34.54 R38.1 55.71,34.51 55.37,34.16 55.37,33.4 54.86,32.89 R28.1 | 56.9,34.54 56.9,34.67 | 56.9,34.54 R29.1
N$37
  Top 0.254: R47.1 71.63,17.27 70.59,16.23 U$16.1
N$40  (via drill 0.61)
  Top 0.254: R30.1 72.99,28.36 U$11.P$4
  Bottom 0.254: U$11.P$4 70.74,30.48 70.36,30.1 70.48,30.1 U$11.P$4
  Bottom 1.016: 70.48,30.1 70.61,30.1 70.87,29.84 70.74,29.72 R13.2
  other vias: 70.87,30.48
N$41
  Top 0.254: C18.1 69.94,34.2 71.46,32.68 R20.1 71.46,32.42 71.84,32.42 72.86,31.41 R31.2 R30.2
N$42
  Top 0.254: R12.1 60.58,18.29 60.71,18.16 R34.2 60.79,18.12 60.96,18.29 SJ1.2
N$43
  Bottom 0.254: SJ2.2 75.78,22.01 R8.1 75.82,21.84 R32.2
N$44
  Top 0.254: C32.1 12.91,19.01 13.34,19.43 U$8.3
N$45
  Bottom 0.254: R26.2 72.64,20.45 72.39,20.19 R33.1
N$46
  Bottom 0.254: R25.2 74.13,15.46 74.08,16.68 R36.1
N$47
  Top 0.254: R38.2 54.01,34.46 | 54.01,34.46 R37.1 | 54.01,34.46 53.98,34.42
N$48  (via drill 0.61)
  Top 0.254: D13.2 D13.1 61.42,34.37 61.47,34.42 61.72,34.16 61.72,32.77 v61.98,32.51 | IC5.1 64.74,36.42 v64.77,37.21
  Bottom 0.254: v64.77,37.21 64.77,35.43 61.98,32.64 v61.98,32.51
N$49
  Top 0.254: R42.2 R39.1 62.32,30.65 61.34,31.62 60.96,31.62 60.45,32.13 | 60.45,32.13 60.45,32 60.58,31.88 | D13.3 60.45,32.13
N$50
  Top 0.254: R37.2 55.75,36.58 56.01,36.32 SJ3.2 | R39.2 60.07,30.48 58.55,32 58.55,35.69 57.53,36.45 57.4,36.32 SJ3.2 | U$1.3 61.78,39.3 61.59,39.12 R53.2 61.34,39.12 61.43,39.03 R27.2 61.47,37.72 60.58,36.83 58.04,36.83 57.53,36.32 SJ3.2
N$51
  Top 0.254: IC5.4 67.37,34.1 67.82,33.66 67.82,33.15 68.41,32.55 R21.1 68.45,32.51 | 68.45,32.51 R20.2 | C24.1 68.41,32.47 68.45,32.51
N$52
  Top 0.254: IC5.3 63.43,34.1 63.08,34.46 R41.2 62.99,34.16 63.67,33.49 R40.1
N$53
  Top 0.254: 66.71,32.55 R21.2 | 66.71,32.55 C24.2 R42.1 | 66.71,32.55 66.8,32.64
N$54
  Top 0.254: R31.1 73.15,33.27 72.9,33.27 72.77,33.4 72.77,34.92 JP2.1
N$55
  Top 0.254: R48.1 74.21,17.44 74.04,17.27 75.97,15.34 U$16.16
N$56
  Top 0.254: R46.2 LED_HIGH.C
N$57
  Top 0.254: LED_GOOD.C 71.88,20.6 71.88,19.94 72.01,19.94 | 72.01,19.94 72.01,20.32 | R47.2 72.01,19.94
N$58
  Top 0.254: R48.2 LED_MID.C
N$59
  Top 0.254: 61.34,40.26 61.21,40.39 61.21,41.53 R45.1 | 61.34,40.26 C23.2 | U$1.2 61.65,39.95 61.34,40.26
N$60
  Top 0.254: C22.2 59.82,42.8 59.75,42.74 R45.2
N$61
  Top 0.254: U$16.15 76.9,14.29 77.22,14.61 77.22,16.64 76.58,17.27 R49.1
N$62
  Top 0.254: R49.2 LED_LOW.C
N$66
  Top 0.254: U$18.3 34.42,20.7 34.16,20.45 34.16,19.43 34.29,18.92 C33.1
N$68
  Bottom 0.406: Q3.4 47.75,34.92 46.65,36.03 C38.2 R52.1 45.47,37.38 45.47,36.79 | D15.1 D15.2 45.47,36.79 | 45.47,36.79 45.47,36.7
N$69  (via drill 0.61)
  Top 0.406: C37.- 28.96,44.2 29.08,44.07 | C34.- 2.41,44.32 2.67,44.07 | 47.75,41.66 v47.75,41.27
  Top 0.61: 29.08,44.07 45.34,44.07 47.75,41.66 | 2.67,44.07 3.43,44.07 3.43,43.56 28.45,43.56 28.45,44.07 C37.-
  Bottom 0.406: v47.75,41.27 47.75,41.53 | Q3.5 Q3.6 | Q3.6 49.08,39.3 49.15,39.37 | Q3.6 Q3.7 | Q3.7 50.36,39.3 50.42,39.24 | Q3.8 51.56,39.5 51.37,39.3 Q3.7
  Bottom 0.61: v47.75,41.27 Q3.5
N$73  (via drill 0.61)
  Top 0.254: U$6.8 59.18,19.94 60.71,21.46 v60.71,21.84
  Bottom 0.254: v60.71,21.84 60.71,22.1 60.83,22.23 | D16.3 60.83,21.72 v60.71,21.84 | v60.71,21.84 60.71,21.46 60.62,21.55 C12.1
P5V_DIRTY  (via drill 0.61, 1.3)
  Top 0.254: 36.96,13.21 36.58,13.84 38.23,15.49 R3.2 38.23,17.65 38.01,17.44 C6.1 | 28.96,8.13 29.08,8.13 R6.1
  Top 0.406: 36.2,13.34 35.94,13.34 36.45,13.34 | 36.7,13.21 36.7,13.34 36.45,13.34 | 36.45,13.34 v35.18,13.34
  Top 1.016: v35.69,15.37 35.69,13.34 35.26,13.41 C4.+ 35.94,13.34 36.07,13.34 35.94,13.21 36.7,13.21 36.96,13.21 v40.01,14.22
  Top 1.27: J2.2 29.08,8.13 29.08,9.02 30.99,10.92 32.64,10.92 34.92,13.21 35.23,13.41 35.26,13.41
  Bottom 0.406: C48.1 C43.1 35.94,11.77 | C44.1 C47.1 37.97,11.81 | 35.94,11.77 35.18,11.77 v35.18,13.34 | 35.94,11.77 C44.1 | C44.1 36.45,11.81
  Bottom 1.27: 42.04,27.43 42.16,27.56 42.16,28.19 | 42.16,28.19 U$10.P$3 | v40.01,14.22 U$10.P$2 | v35.69,15.37 35.69,19.05 41.4,24.77 41.4,27.81 41.78,28.19 42.16,28.19
P5V_NUM  (via drill 0.61, 0.61 pad 1.02, 1.3)
  Top 0.254: U$16.3 69.28,13.65 v68.71,13.46 69.09,13.46 68.83,13.21 68.83,10.03 66.42,7.62 61.85,7.62 61.47,7.24 60.07,7.24 54.74,1.91 45.34,1.91 43.31,3.94 43.31,6.99 40.13,10.16 40.13,11.05 | 16.51,11.94 17.65,11.81 21.08,11.81 21.21,12.06 R5.1 | 14.99,12.06 16.13,12.06 16.38,11.81 16.46,11.89 C1.+ 16.46,11.86 v16.51,11.81 17.27,12.95 17.27,16.76 17.14,16.89 C2.1 15.41,16.93 15.37,16.89 R1.1 | v50.16,17.78 49.78,17.91 46.99,17.91 40.13,11.05 | 40.13,11.05 36.7,11.05 34.42,8.76 34.42,7.37 33.91,6.86 32.38,6.86 30.99,5.46 30.99,3.81 29.59,2.41 28.57,2.41 27.18,3.81 27.18,5.84 25.91,7.11 25.65,7.11 | J1.2 17.53,4.83 19.3,6.6 22.48,6.6 22.99,7.11 25.65,7.11 | 25.65,7.11 25.78,7.11 | R40.2 65.37,32.73 65.66,33.02 65.66,33.27 66.04,33.66 66.04,34.42 66.8,35.18 | 66.8,35.18 67.56,35.94 IC5.5 67.34,36.42 66.42,37.34 66.42,40.64 67.69,40.64 67.65,40.6 U$1.8 67.63,42.1 67.69,42.16 67.53,42.2 C17.1 67.82,42.2 67.82,42.04 R16.1 | v66.29,35.69 66.8,35.18 | LED_GOOD.A LED_HIGH.A 69.72,24.51 69.22,24.51 v69.09,24.13 | LED_GOOD.A LED_MID.A | LED_MID.A LED_LOW.A 76.43,24.1 76.33,24 76.23,24.1 LED_MID.A | LED_GOOD.A LED_MID.A | LED_MID.A 74.39,24.1 74.55,24.26
  Top 0.406: 16.13,11.81 C1.+ v16.51,11.81
  Top 1.27: v15.75,14.35 15.75,12.7 16.51,11.94 C1.+ v16.51,11.81 17.65,11.81 19.43,14.1 v19.43,14.35
  Top 1.422: 16.38,11.81 16.38,5.33 J1.2
  Bottom 0.254: 68.83,13.84 68.83,13.72 v68.71,13.46 69.09,13.97 69.09,15.11 69.98,16 69.98,16.13 70.65,16.8 C30.1 70.7,16.73 70.74,16.76 70.74,17.14 69.85,18.03 69.85,22.35 69.09,23.11 69.09,24.26 | R17.2 54.19,14.39 52.32,16.26 R18.1 52.16,16.3 51.9,16.55 D12.2 51.88,18.61 51.31,18.03 50.16,18.03 v50.16,17.78 | v66.29,35.69 67.06,34.92 67.06,28.57 69.09,26.54 69.09,24.26 | 69.09,24.26 v69.09,24.13
  Bottom 0.406: 16.51,10.25 C45.1 | C42.1 C41.1 | C42.1 C46.1 | C41.1 18.8,10.29 | C42.1 C41.1 | 16.51,10.25 C42.1 | v16.51,11.81 16.51,10.25
  Bottom 1.016: U$5.P$3 20.07,28.83 20.07,21.59 15.75,17.27 v15.75,14.35
  Bottom 1.27: v19.43,14.35 U$5.P$2
V_ALIM  (via drill 0.61, 1.3)
  Top 0.254: v55.12,25.65 65.66,25.65 66.67,26.67 v70.74,26.67 | 29.08,38.61 28.83,38.61 | 49.91,24.13 49.78,24.26 K2.C
  Top 0.305: 2.54,38.99 C34.+ | 28.83,38.61 28.96,38.73 C37.+
  Top 0.406: 45.34,38.1 45.53,38.04 v46.48,39.12 | C26.1 30.31,21.68 30.35,21.72 30.23,21.84 30.23,22.48 | 9.08,22.8 9.02,22.86 8.85,22.69 C25.1
  Top 0.61: 2.54,38.99 4.57,42.04 26.04,42.04 28.83,38.61 | 29.08,38.61 31.37,40.89 42.67,40.89 45.53,38.04 46.99,36.58 46.99,27.05 49.78,24.26
  Top 1.016: U$8.2 12.06,22.73 11.56,23.24 | U$18.2 33.15,22.86 32.77,23.24
  Top 1.27: 11.43,23.37 11.56,23.24 9.53,23.24 | 8.89,22.61 9.08,22.8 9.53,23.24 | 9.53,23.24 8.89,23.24 8.26,23.88 8.26,32 7.87,32.38 v7.87,32.64 v7.87,34.42 | 32.64,23.37 32.77,23.24 30.99,23.24 | 30.99,23.24 30.23,22.48 | 30.99,23.24 29.59,23.24 29.34,23.5 29.34,32.38 | v28.96,34.42 v28.96,32.64 | v28.96,32.64 28.96,32.38 29.34,32.38 | v28.96,32.64 29.34,32.38
  Bottom 0.254: K2.C 53.74,24.27 v55.12,25.65 | 75.56,25.02 74.3,26.29 71.12,26.29 v70.74,26.67 | 30.23,34.42 C27.1 29.96,34.42
  Bottom 0.406: R52.2 46.39,39.08 v46.48,39.12 | R32.1 75.82,25.02 75.56,25.02 | D15.3 44.37,34.59 43.37,33.59
  Bottom 1.016: 7.87,36.2 9.4,36.2 11.94,38.73 25.27,38.73 29.97,34.04 | 29.97,34.04 30.09,34.15 C27.1 | 29.97,34.04 29.97,35.43
  Bottom 1.27: C36.1 v7.87,34.42 v7.87,32.64 7.87,36.2 | 29.97,35.43 33.15,38.61 38.35,38.61 43.37,33.59 49.78,27.18 K2.C 49.78,24.26 | 29.96,34.42 v28.96,34.42 v28.96,32.64 28.96,36.2
V_BAT
  Top 0.254: 56.98,31.15 R29.2 | 56.98,31.15 R28.2 54.78,31.15 54.48,30.86 54.48,29.46 54.1,29.08 D14.C | 56.98,31.15 57.02,31.11 | C16.+ 51.44,30.23 51.56,30.23 52.07,29.72
  Top 0.61: 54.23,12.19 54.23,17.27 52.07,19.43 52.07,22.61 53.47,24.77 53.47,28.19 53.98,28.96
  Top 1.016: 53.98,28.96 53.72,28.96 52.32,30.35 50.55,30.35 50.42,30.23 C16.+
  Top 1.27: J_BUTTON.1 49.66,6.22 54.78,11.35 K2.NC 54.78,11.64 54.23,12.19 | 53.98,28.96 D14.C
V_NESTOR  (via drill 0.61)
  Top 0.406: v57.28,18.29 R12.2
  Top 1.27: 44.78,11.51 44.96,11.56 | 44.78,11.51 K2.NO | 44.78,11.51 45.26,11.51 POLY2.2
  Bottom 0.254: 58.11,19.94 59.69,19.94 59.86,19.77 D16.1 | R7.1 44.54,7.91 44.96,7.49 | 57.53,19.81 57.53,19.94 57.66,19.94
  Bottom 0.406: 57.66,18.29 v57.28,18.29 | 57.91,25.65 57.91,25.4 C28.1
  Bottom 0.61: 57.66,19.94 57.66,18.29 57.66,11.05 55.75,9.14 49.66,9.14 POLY2.2 | 57.66,19.94 57.66,25.02 57.91,25.27 | 57.66,19.94 58.11,19.94 | 57.66,19.94 57.65,19.94
  Bottom 1.27: D8.C 44.96,7.49 45.47,8 | 57.91,25.27 57.91,25.65 57.91,28.96 U$11.P$1 57.4,30.61 | D8.C | POLY2.2 45.72,8.13 D8.C
VREF_1V2  (via drill 0.61)
  Top 0.254: 71.63,9.4 70.74,9.4 70.61,9.53 v70.61,9.65 70.59,10.52 U$16.8 69.66,10.48 69.34,10.79 69.34,12.19 69.53,12.38 U$16.5 | 71.63,9.4 71.75,9.4 | 72.01,9.53 71.92,9.49 R50.1 71.63,9.4
  Bottom 0.254: C31.1 70.78,12.48 70.74,12.7 | 70.74,12.7 R22.1 | v70.61,9.65 70.61,12.45 70.74,12.57 70.74,12.7

### Text on the board
Top: 5V_Proper : elec | 5V_Dirty : servos | For 12V operation : | solder SJ1, SJ2, SJ3 | Hcc
Bottom: Nestor : 10V-30V | Power supply 1 | Bat : 10V-30V | APBTeam - PP | Out : 2 x 5V@4A | 2008 | s2 | + | + | + | + | 5vD | 5vP | nes | but | bat
_tsilk: Power supply 1 | PP - APBTeam - 2008 | Hcc | SJ3 | 22µ/50V | LM2931D | Bat_state | LM2678S | LM2678S | MAX969 | SJ1 | 47u | 47u | CQ1-12V | nes_act | + | + | + | + | MC2-G | Dirt | MC2-G | Prp | MC2-G | Nes | MC2-G | Button | MC2-G | Bat